# Altium schematic sheet AnalogInputFiltering.SchDoc
size A
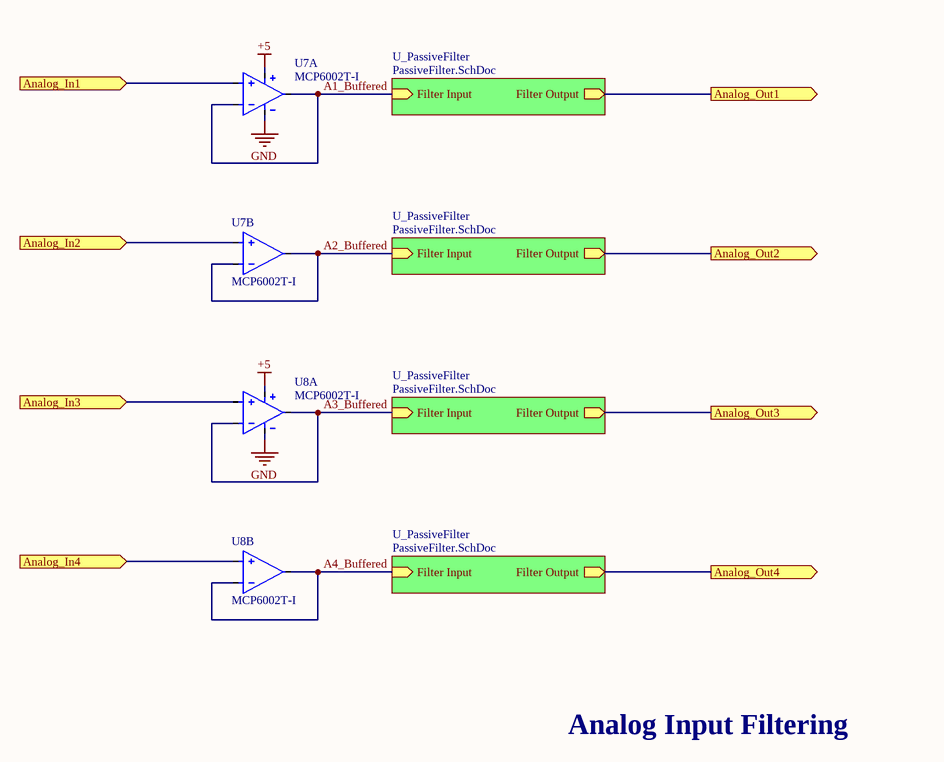
[diagram p0: AnalogInputFiltering.SchDoc]

## Parts
U7  MCP6002T-I  [SOIC-8]  (parts A,B of 2)
U8  MCP6002T-I  [SOIC-8]  (parts A,B of 2)

## Sub-sheets
U_PassiveFilter = PassiveFilter.SchDoc: Filter Input (in), Filter Output (out)
U_PassiveFilter = PassiveFilter.SchDoc: Filter Input (in), Filter Output (out)
U_PassiveFilter = PassiveFilter.SchDoc: Filter Input (in), Filter Output (out)
U_PassiveFilter = PassiveFilter.SchDoc: Filter Input (in), Filter Output (out)

## Ports
Analog_In1 (in), Analog_In2 (in), Analog_In3 (in), Analog_In4 (in), Analog_Out1 (out), Analog_Out2 (out), Analog_Out3 (out), Analog_Out4 (out)

## Nets
+5: U7.8(V+) U8.8(V+)
GND: U7.4(V-) U8.4(V-)
A1_Buffered: U7.1(OUT_A) U7.2(-IN_A) ; sheet U_PassiveFilter/Filter Input
A2_Buffered: U7.6(-IN_B) U7.7(OUT_B) ; sheet U_PassiveFilter/Filter Input
A3_Buffered: U8.1(OUT_A) U8.2(-IN_A) ; sheet U_PassiveFilter/Filter Input
A4_Buffered: U8.6(-IN_B) U8.7(OUT_B) ; sheet U_PassiveFilter/Filter Input
Analog_In1: U7.3(+IN_A) ; port Analog_In1
Analog_In2: U7.5(+IN_B) ; port Analog_In2
Analog_In3: U8.3(+IN_A) ; port Analog_In3
Analog_In4: U8.5(+IN_B) ; port Analog_In4
Analog_Out1: port Analog_Out1, sheet U_PassiveFilter/Filter Output
Analog_Out2: port Analog_Out2, sheet U_PassiveFilter/Filter Output
Analog_Out3: port Analog_Out3, sheet U_PassiveFilter/Filter Output
Analog_Out4: port Analog_Out4, sheet U_PassiveFilter/Filter Output

## Notes on the sheet
- Analog Input Filtering

## Library data of the parts
U7 U8 = 2: Rail-to-Rail 2 Circuit OPAMP 8SOIC; id: 2; voltage: 6; slewrate: 0.600000023841858; gbw: 0; currentoutput: 23; voltagelow: 1.79999995231628; Name: MCP6002T-I; num_circuits: 2; voltagehigh: 6; quantity: 0; link: https://www.digikey.com/product-detail/en/microchip-technology/MCP6002T-I-SN/MCP6002T-I-SNCT-ND/4307905; createdby: Kevin